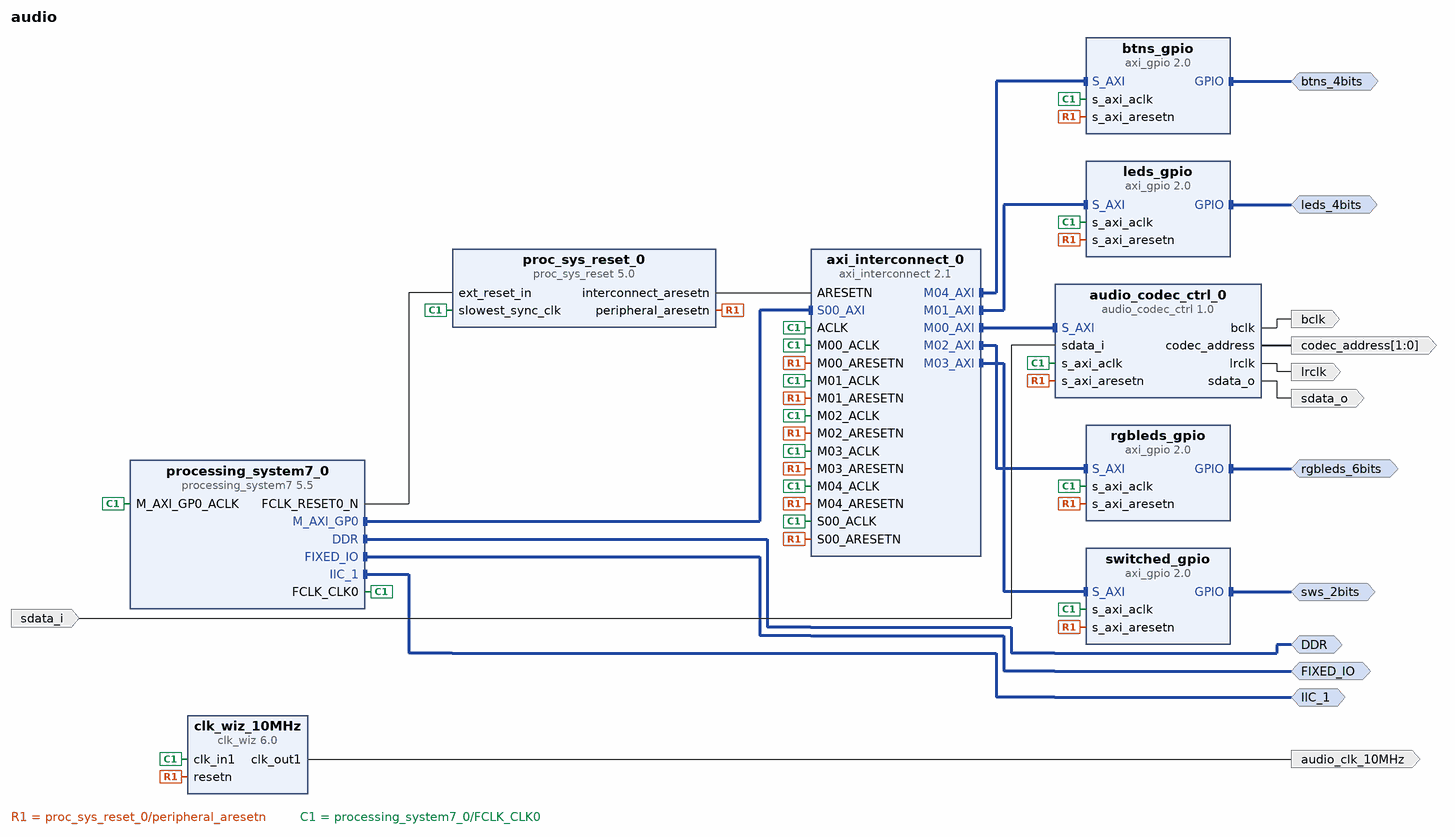
[diagram p0: block diagram of the top level]
# Vivado block design audio, xc7z020clg400-1, Vivado 2024.2
create_bd_design audio

create_bd_intf_port -mode Master -vlnv xilinx.com:interface:iic_rtl:1.0 IIC_1
create_bd_intf_port -mode Master -vlnv xilinx.com:display_processing_system7:fixedio_rtl:1.0 FIXED_IO
create_bd_intf_port -mode Master -vlnv xilinx.com:interface:ddrx_rtl:1.0 DDR
create_bd_intf_port -mode Master -vlnv xilinx.com:interface:gpio_rtl:1.0 leds_4bits
create_bd_intf_port -mode Master -vlnv xilinx.com:interface:gpio_rtl:1.0 sws_2bits
create_bd_intf_port -mode Master -vlnv xilinx.com:interface:gpio_rtl:1.0 rgbleds_6bits
create_bd_intf_port -mode Master -vlnv xilinx.com:interface:gpio_rtl:1.0 btns_4bits
create_bd_port -dir O bclk
create_bd_port -dir O lrclk
create_bd_port -dir O sdata_o
create_bd_port -dir O -from 1 -to 0 codec_address
create_bd_port -dir I sdata_i
create_bd_port -dir O -type clk audio_clk_10MHz

create_bd_cell -type ip -vlnv xilinx.com:ip:processing_system7:5.5 processing_system7_0
set_property -dict [list \
  CONFIG.PCW_CRYSTAL_PERIPHERAL_FREQMHZ 50 \
  CONFIG.PCW_FPGA0_PERIPHERAL_FREQMHZ 100 \
  CONFIG.PCW_I2C1_I2C1_IO EMIO \
  CONFIG.PCW_I2C1_PERIPHERAL_ENABLE 1 \
  CONFIG.PCW_I2C_PERIPHERAL_FREQMHZ 108.333336 \
] [get_bd_cells processing_system7_0]
# 32 more settings of processing_system7_0 are not shown: defaults, MIO pin electricals, DDR timing, and values the tool derives
create_bd_cell -type ip -vlnv xilinx.com:ip:axi_interconnect:2.1 axi_interconnect_0
set_property -dict {CONFIG.NUM_MI 5 CONFIG.S00_HAS_REGSLICE 1} [get_bd_cells axi_interconnect_0]
create_bd_cell -type ip -vlnv xilinx.com:ip:clk_wiz:6.0 clk_wiz_10MHz
set_property -dict [list \
  CONFIG.CLKOUT1_JITTER 631.442 \
  CONFIG.CLKOUT1_PHASE_ERROR 346.848 \
  CONFIG.CLKOUT1_REQUESTED_OUT_FREQ 5.000 \
  CONFIG.MMCM_CLKFBOUT_MULT_F 32.000 \
  CONFIG.MMCM_CLKOUT0_DIVIDE_F 128.000 \
  CONFIG.MMCM_DIVCLK_DIVIDE 5 \
  CONFIG.RESET_PORT resetn \
  CONFIG.RESET_TYPE ACTIVE_LOW \
] [get_bd_cells clk_wiz_10MHz]
create_bd_cell -type ip -vlnv xilinx.com:ip:proc_sys_reset:5.0 proc_sys_reset_0
create_bd_cell -type ip -vlnv xilinx.com:user:audio_codec_ctrl:1.0 audio_codec_ctrl_0
create_bd_cell -type ip -vlnv xilinx.com:ip:axi_gpio:2.0 switched_gpio
set_property -dict {CONFIG.C_ALL_INPUTS 1 CONFIG.C_GPIO_WIDTH 2 CONFIG.C_INTERRUPT_PRESENT 1} [get_bd_cells switched_gpio]
create_bd_cell -type ip -vlnv xilinx.com:ip:axi_gpio:2.0 leds_gpio
set_property -dict {CONFIG.C_ALL_OUTPUTS 1 CONFIG.C_GPIO_WIDTH 4 CONFIG.C_INTERRUPT_PRESENT 1} [get_bd_cells leds_gpio]
create_bd_cell -type ip -vlnv xilinx.com:ip:axi_gpio:2.0 rgbleds_gpio
set_property -dict [list \
  CONFIG.C_ALL_INPUTS 0 \
  CONFIG.C_ALL_OUTPUTS 1 \
  CONFIG.C_GPIO_WIDTH 6 \
  CONFIG.C_INTERRUPT_PRESENT 1 \
] [get_bd_cells rgbleds_gpio]
create_bd_cell -type ip -vlnv xilinx.com:ip:axi_gpio:2.0 btns_gpio
set_property -dict {CONFIG.C_ALL_INPUTS 1 CONFIG.C_GPIO_WIDTH 4} [get_bd_cells btns_gpio]

# ---- connections ----

connect_bd_intf_net [get_bd_intf_pins axi_interconnect_0/M00_AXI] [get_bd_intf_pins audio_codec_ctrl_0/S_AXI]
connect_bd_intf_net [get_bd_intf_pins leds_gpio/S_AXI] [get_bd_intf_pins axi_interconnect_0/M01_AXI]
connect_bd_intf_net [get_bd_intf_pins rgbleds_gpio/S_AXI] [get_bd_intf_pins axi_interconnect_0/M02_AXI]
connect_bd_intf_net [get_bd_intf_pins switched_gpio/S_AXI] [get_bd_intf_pins axi_interconnect_0/M03_AXI]
connect_bd_intf_net [get_bd_intf_pins btns_gpio/S_AXI] [get_bd_intf_pins axi_interconnect_0/M04_AXI]
connect_bd_intf_net [get_bd_intf_ports btns_4bits] [get_bd_intf_pins btns_gpio/GPIO]
connect_bd_intf_net [get_bd_intf_ports leds_4bits] [get_bd_intf_pins leds_gpio/GPIO]
connect_bd_intf_net [get_bd_intf_ports DDR] [get_bd_intf_pins processing_system7_0/DDR]
connect_bd_intf_net [get_bd_intf_ports FIXED_IO] [get_bd_intf_pins processing_system7_0/FIXED_IO]
connect_bd_intf_net [get_bd_intf_ports IIC_1] [get_bd_intf_pins processing_system7_0/IIC_1]
connect_bd_intf_net [get_bd_intf_pins processing_system7_0/M_AXI_GP0] [get_bd_intf_pins axi_interconnect_0/S00_AXI]
connect_bd_intf_net [get_bd_intf_ports rgbleds_6bits] [get_bd_intf_pins rgbleds_gpio/GPIO]
connect_bd_intf_net [get_bd_intf_ports sws_2bits] [get_bd_intf_pins switched_gpio/GPIO]
connect_bd_net [get_bd_pins audio_codec_ctrl_0/bclk] [get_bd_ports bclk]
connect_bd_net [get_bd_pins audio_codec_ctrl_0/codec_address] [get_bd_ports codec_address]
connect_bd_net [get_bd_pins audio_codec_ctrl_0/lrclk] [get_bd_ports lrclk]
connect_bd_net [get_bd_pins audio_codec_ctrl_0/sdata_o] [get_bd_ports sdata_o]
connect_bd_net -net clk_wiz_0_clk_out1 [get_bd_pins clk_wiz_10MHz/clk_out1] [get_bd_ports audio_clk_10MHz]
connect_bd_net [get_bd_pins proc_sys_reset_0/interconnect_aresetn] [get_bd_pins axi_interconnect_0/ARESETN]
connect_bd_net [get_bd_pins proc_sys_reset_0/peripheral_aresetn] \
  [get_bd_pins audio_codec_ctrl_0/s_axi_aresetn] [get_bd_pins switched_gpio/s_axi_aresetn] \
  [get_bd_pins leds_gpio/s_axi_aresetn] [get_bd_pins rgbleds_gpio/s_axi_aresetn] [get_bd_pins btns_gpio/s_axi_aresetn] \
  [get_bd_pins axi_interconnect_0/S00_ARESETN] [get_bd_pins axi_interconnect_0/M00_ARESETN] \
  [get_bd_pins axi_interconnect_0/M01_ARESETN] [get_bd_pins axi_interconnect_0/M02_ARESETN] \
  [get_bd_pins axi_interconnect_0/M03_ARESETN] [get_bd_pins axi_interconnect_0/M04_ARESETN] \
  [get_bd_pins clk_wiz_10MHz/resetn]
connect_bd_net [get_bd_pins processing_system7_0/FCLK_CLK0] \
  [get_bd_pins processing_system7_0/M_AXI_GP0_ACLK] [get_bd_pins audio_codec_ctrl_0/s_axi_aclk] \
  [get_bd_pins switched_gpio/s_axi_aclk] [get_bd_pins leds_gpio/s_axi_aclk] [get_bd_pins rgbleds_gpio/s_axi_aclk] \
  [get_bd_pins btns_gpio/s_axi_aclk] [get_bd_pins axi_interconnect_0/ACLK] [get_bd_pins axi_interconnect_0/S00_ACLK] \
  [get_bd_pins axi_interconnect_0/M00_ACLK] [get_bd_pins axi_interconnect_0/M01_ACLK] \
  [get_bd_pins axi_interconnect_0/M02_ACLK] [get_bd_pins axi_interconnect_0/M03_ACLK] \
  [get_bd_pins axi_interconnect_0/M04_ACLK] [get_bd_pins clk_wiz_10MHz/clk_in1] \
  [get_bd_pins proc_sys_reset_0/slowest_sync_clk]
connect_bd_net [get_bd_pins processing_system7_0/FCLK_RESET0_N] [get_bd_pins proc_sys_reset_0/ext_reset_in]
connect_bd_net -net sdata_i_0_1 [get_bd_ports sdata_i] [get_bd_pins audio_codec_ctrl_0/sdata_i]

# ---- address map ----
assign_bd_address -offset 0x41200000 -range 64K -target_address_space [get_bd_addr_spaces processing_system7_0/Data] [get_bd_addr_segs leds_gpio/S_AXI/Reg]
assign_bd_address -offset 0x41210000 -range 64K -target_address_space [get_bd_addr_spaces processing_system7_0/Data] [get_bd_addr_segs rgbleds_gpio/S_AXI/Reg]
assign_bd_address -offset 0x41220000 -range 64K -target_address_space [get_bd_addr_spaces processing_system7_0/Data] [get_bd_addr_segs switched_gpio/S_AXI/Reg]
assign_bd_address -offset 0x41230000 -range 64K -target_address_space [get_bd_addr_spaces processing_system7_0/Data] [get_bd_addr_segs btns_gpio/S_AXI/Reg]
assign_bd_address -offset 0x43C00000 -range 64K -target_address_space [get_bd_addr_spaces processing_system7_0/Data] [get_bd_addr_segs audio_codec_ctrl_0/S_AXI/reg0]

validate_bd_design
save_bd_design
